# Altium project radFET-calibration_stand_card.PrjPcb
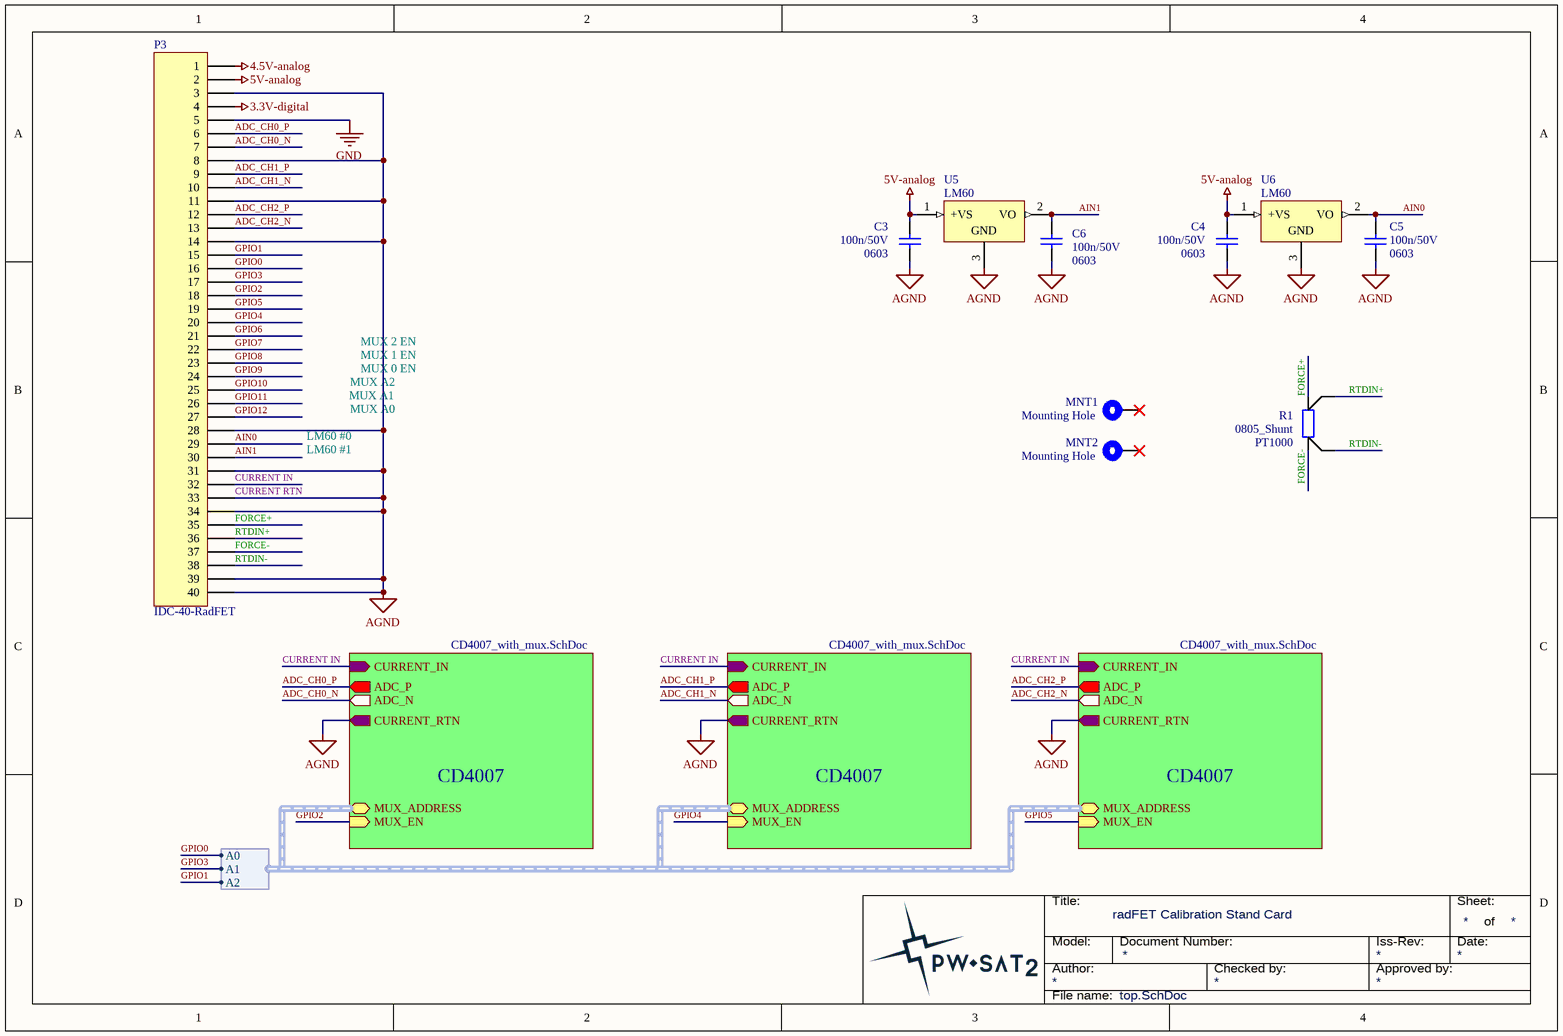
[diagram p0: top.SchDoc]
2 sheets, 100 parts. Net scope: hierarchical (ports join the sheet entries above them; power ports are global).
Board file: pcb.PcbDoc
Sheets:
  top.SchDoc
    CD4007 = CD4007_with_mux.SchDoc
    CD4007 = CD4007_with_mux.SchDoc
    CD4007 = CD4007_with_mux.SchDoc

## Sheet top.SchDoc: radFET Calibration Stand Card
size A4

### Parts
C3  Package: 0603  [SMD_Capacitor_0603]  (hidden comment: 100n/50V)
C4  Package: 0603  [SMD_Capacitor_0603]  (hidden comment: 100n/50V)
C5  Package: 0603  [SMD_Capacitor_0603]  (hidden comment: 100n/50V)
C6  Package: 0603  [SMD_Capacitor_0603]  (hidden comment: 100n/50V)
MNT1  Mounting Hole  [PC-104_PcbMntHole_M3]
MNT2  Mounting Hole  [PC-104_PcbMntHole_M3]
P3  IDC-40-RadFET  [IDC-40-Male-Socket-Angle]
R1  Package: 0805_Shunt  [SMD_Resistor-shunt_0805]  (hidden comment: PT1000)
U5  LM60  [SOT23-3]
U6  LM60  [SOT23-3]

### Sub-sheets
CD4007 = CD4007_with_mux.SchDoc: CURRENT_IN (in), ADC_P (out), ADC_N (out), MUX_EN (in), MUX_ADDRESS (harness MUX_Address), CURRENT_RTN (out)
CD4007 = CD4007_with_mux.SchDoc: CURRENT_IN (in), ADC_P (out), ADC_N (out), MUX_EN (in), MUX_ADDRESS (harness MUX_Address), CURRENT_RTN (out)
CD4007 = CD4007_with_mux.SchDoc: CURRENT_IN (in), ADC_P (out), ADC_N (out), MUX_EN (in), MUX_ADDRESS (harness MUX_Address), CURRENT_RTN (out)

### Harnesses
MUX_Address: A0, A1, A2

### Nets
3.3V-digital: P3.4
4.5V-analog: P3.1
5V-analog: C3.1 C4.1 P3.2 U5.1(+VS) U6.1(+VS)
CURRENT RTN: C3.2 C4.2 C5.2 C6.2 P3.3 P3.8 P3.11 P3.14 P3.28 P3.31 P3.33 P3.34 P3.39 P3.40 U5.3(GND) U6.3(GND) ; sheet CD4007/CURRENT_RTN, sheet CD4007/CURRENT_RTN, sheet CD4007/CURRENT_RTN  [also labelled AGND]
GND: P3.5
ADC_CH0_N: P3.7 ; sheet CD4007/ADC_N
ADC_CH0_P: P3.6 ; sheet CD4007/ADC_P
ADC_CH1_N: P3.10 ; sheet CD4007/ADC_N
ADC_CH1_P: P3.9 ; sheet CD4007/ADC_P
ADC_CH2_N: P3.13 ; sheet CD4007/ADC_N
ADC_CH2_P: P3.12 ; sheet CD4007/ADC_P
AIN0: C5.1 P3.29 U6.2(VO)
AIN1: C6.1 P3.30 U5.2(VO)
CURRENT IN: P3.32 ; sheet CD4007/CURRENT_IN, sheet CD4007/CURRENT_IN, sheet CD4007/CURRENT_IN
FORCE+: P3.35 R1.4
FORCE-: P3.37 R1.1
GPIO0: P3.16 ; sheet CD4007/MUX_ADDRESS.A0
GPIO1: P3.15 ; sheet CD4007/MUX_ADDRESS.A2
GPIO2: P3.18 ; sheet CD4007/MUX_EN
GPIO3: P3.17 ; sheet CD4007/MUX_ADDRESS.A1
GPIO4: P3.20 ; sheet CD4007/MUX_EN
GPIO5: P3.19 ; sheet CD4007/MUX_EN
GPIO6: P3.21
GPIO7: P3.22
GPIO8: P3.23
GPIO9: P3.24
GPIO10: P3.25
GPIO11: P3.26
GPIO12: P3.27
RTDIN+: P3.36 R1.3
RTDIN-: P3.38 R1.2

Not connected (* = marked no-connect by the designer): MNT1 1*; MNT2 1*

### Notes on the sheet
- MUX A2
- MUX 2 EN
- MUX 1 EN
- MUX 0 EN
- LM60 #0
- MUX A1
- MUX A0
- LM60 #1
- Title:
- Sheet:
- of
- Author:
- Model:
- Document Number:
- Checked by:
- Iss-Rev:
- Approved by:
- Date:
- File name:

### Library data of the parts
C3-C6 = Cer_C0603T104K5RALTU: Ceramic Cap Kemet COTS 100n/50V X7R 0603; Manufacturer: Kemet; ManufacturerPartNumber: C0603T104K5RALTU; Value: 100n/50V
MNT1 MNT2 = MntHole: PCB Mounting Hole; Value: Mounting Hole
R1 = PT1000: Platinum Thin-Film Chip Sensor; Manufacturer: IST INNOVATIVE SENSOR TECHNOLOGY; ManufacturerPartNumber: P1K0.0805.2P.A; TCR: 3850ppm/K; Farnell: http://pl.farnell.com/ist-innovative-sensor-technology/p1k0-0805-2p-a/sensor-pt1000-smd0805-class-a/dp/1266951; Manufacturer's Datasheet: http://www.farnell.com/datasheets/57422.pdf; Value: PT1000
U5 U6 = LM60: Analog temperature sensor
P3 = IDC-40-RadFET: LatestRevisionDate: 17-Jul-2002; LatestRevisionNote: Re-released for DXP Platform.; Publisher: Altium Limited

## Sheet CD4007_with_mux.SchDoc: CD4007 with mux
size A3
Used 3 times, as channels CD4007, CD4007, CD4007. Parts and nets are listed once, with the designators drawn on the sheet.
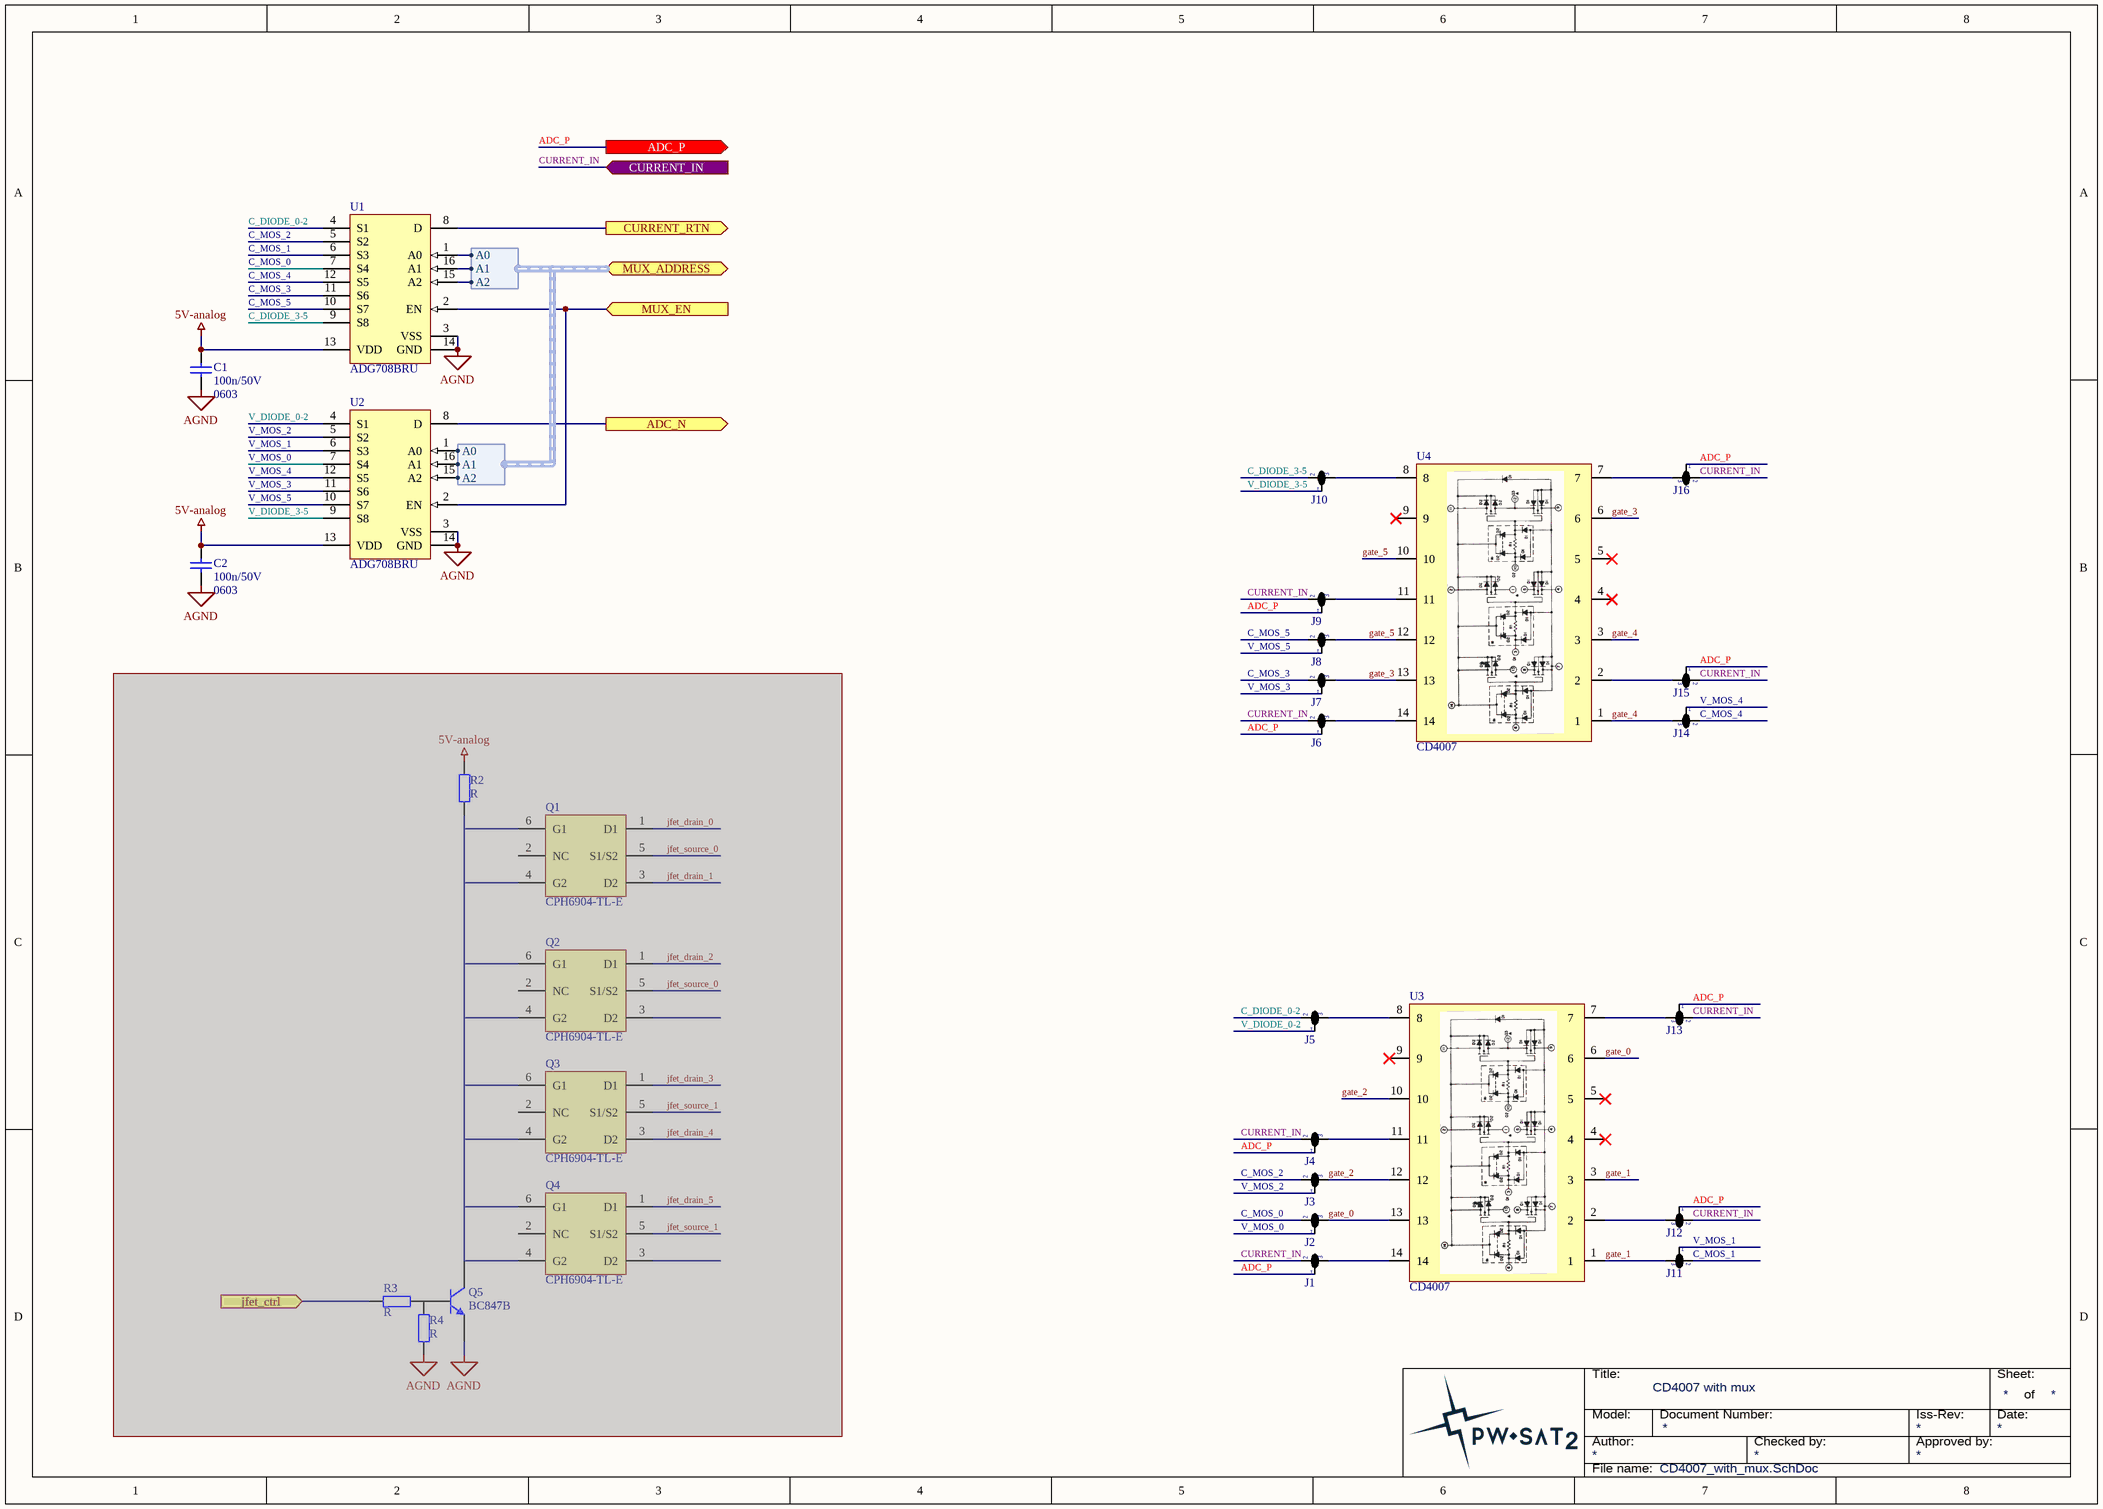
[diagram p1: CD4007_with_mux.SchDoc]

### Parts
C1  Package: 0603  [SMD_Capacitor_0603]  (hidden comment: 100n/50V)
C2  Package: 0603  [SMD_Capacitor_0603]  (hidden comment: 100n/50V)
J1  3 way net tie junction T shape  [3WaySplitter-RadFET - Test]  (value not drawn)  (net tie, no BOM)
J2  3 way net tie junction T shape  [3WaySplitter-RadFET - Test]  (value not drawn)  (net tie, no BOM)
J3  3 way net tie junction T shape  [3WaySplitter-RadFET - Test]  (value not drawn)  (net tie, no BOM)
J4  3 way net tie junction T shape  [3WaySplitter-RadFET - Test]  (value not drawn)  (net tie, no BOM)
J5  3 way net tie junction T shape  [3WaySplitter-RadFET - Test]  (value not drawn)  (net tie, no BOM)
J6  3 way net tie junction T shape  [3WaySplitter-RadFET - Test]  (value not drawn)  (net tie, no BOM)
J7  3 way net tie junction T shape  [3WaySplitter-RadFET - Test]  (value not drawn)  (net tie, no BOM)
J8  3 way net tie junction T shape  [3WaySplitter-RadFET - Test]  (value not drawn)  (net tie, no BOM)
J9  3 way net tie junction T shape  [3WaySplitter-RadFET - Test]  (value not drawn)  (net tie, no BOM)
J10  3 way net tie junction T shape  [3WaySplitter-RadFET - Test]  (value not drawn)  (net tie, no BOM)
J11  3 way net tie junction T shape  [3WaySplitter-RadFET - Test]  (value not drawn)  (net tie, no BOM)
J12  3 way net tie junction T shape  [3WaySplitter-RadFET - Test]  (value not drawn)  (net tie, no BOM)
J13  3 way net tie junction T shape  [3WaySplitter-RadFET - Test]  (value not drawn)  (net tie, no BOM)
J14  3 way net tie junction T shape  [3WaySplitter-RadFET - Test]  (value not drawn)  (net tie, no BOM)
J15  3 way net tie junction T shape  [3WaySplitter-RadFET - Test]  (value not drawn)  (net tie, no BOM)
J16  3 way net tie junction T shape  [3WaySplitter-RadFET - Test]  (value not drawn)  (net tie, no BOM)
Q1  CPH6904-TL-E  [ONSC-CPH-6_V]  (masked out: inside a compile mask, not in the netlist)
Q2  CPH6904-TL-E  [ONSC-CPH-6_V]  (masked out: inside a compile mask, not in the netlist)
Q3  CPH6904-TL-E  [ONSC-CPH-6_V]  (masked out: inside a compile mask, not in the netlist)
Q4  CPH6904-TL-E  [ONSC-CPH-6_V]  (masked out: inside a compile mask, not in the netlist)
Q5  BC847B  [SOT-23_M]  (masked out: inside a compile mask, not in the netlist)
R2  R  [0603]  (masked out: inside a compile mask, not in the netlist)
R3  R  [0603]  (masked out: inside a compile mask, not in the netlist)
R4  R  [0603]  (masked out: inside a compile mask, not in the netlist)
U1  ADG708BRU  [ADI-RU-16_N]
U2  ADG708BRU  [ADI-RU-16_N]
U3  CD4007  [TSSOP14]
U4  CD4007  [TSSOP14]

### Ports
ADC_N (out), ADC_P (out), CURRENT_IN (in), CURRENT_RTN (out), jfet_ctrl (in), MUX_ADDRESS (harness MUX_Address), MUX_EN (in)

### Harnesses
MUX_Address: A0, A1, A2

### Nets
5V-analog: C1.1 C2.1 U1.13(VDD) U2.13(VDD)
AGND: C1.2 C2.2 U1.3(VSS) U1.14(GND) U2.3(VSS) U2.14(GND)
ADC_N: U2.8(D) ; port ADC_N
ADC_P: J1.1 J4.1 J6.1 J9.1 J12.1 J13.1 J15.1 J16.1 ; port ADC_P
C_DIODE_0-2: J5.2 U1.4(S1)
C_DIODE_3-5: J10.2 U1.9(S8)
C_MOS_0: J2.2 U1.7(S4)
C_MOS_1: J11.2 U1.6(S3)
C_MOS_2: J3.2 U1.5(S2)
C_MOS_3: J7.2 U1.11(S6)
C_MOS_4: J14.2 U1.12(S5)
C_MOS_5: J8.2 U1.10(S7)
CURRENT_IN: J1.2 J4.2 J6.2 J9.2 J12.2 J13.2 J15.2 J16.2 ; port CURRENT_IN
CURRENT_RTN: U1.8(D) ; port CURRENT_RTN
gate_0: J2.3 U3.6 U3.13
gate_1: J11.3 U3.1 U3.3
gate_2: J3.3 U3.10 U3.12
gate_3: J7.3 U4.6 U4.13
gate_4: J14.3 U4.1 U4.3
gate_5: J8.3 U4.10 U4.12
MUX_EN: U1.2(EN) U2.2(EN) ; port MUX_EN
V_DIODE_0-2: J5.1 U2.4(S1)
V_DIODE_3-5: J10.1 U2.9(S8)
V_MOS_0: J2.1 U2.7(S4)
V_MOS_1: J11.1 U2.6(S3)
V_MOS_2: J3.1 U2.5(S2)
V_MOS_3: J7.1 U2.11(S6)
V_MOS_4: J14.1 U2.12(S5)
V_MOS_5: J8.1 U2.10(S7)
NetJ1_3: J1.3 U3.14
NetJ4_3: J4.3 U3.11
NetJ5_3: J5.3 U3.8
NetJ6_3: J6.3 U4.14
NetJ9_3: J9.3 U4.11
NetJ10_3: J10.3 U4.8
NetJ12_3: J12.3 U3.2
NetJ13_3: J13.3 U3.7
NetJ15_3: J15.3 U4.2
NetJ16_3: J16.3 U4.7
NetU1_1: U1.1(A0) U2.1(A0) ; port MUX_ADDRESS.A0
NetU1_15: U1.15(A2) U2.15(A2) ; port MUX_ADDRESS.A2
NetU1_16: U1.16(A1) U2.16(A1) ; port MUX_ADDRESS.A1

Not connected (* = marked no-connect by the designer): U3 4* 5* 9*; U4 4* 5* 9*

### Channels
CD4007: designators C1=C1_CD40073 C2=C2_CD40073 J1=J1_CD40073 J2=J2_CD40073 J3=J3_CD40073 J4=J4_CD40073 J5=J5_CD40073 J6=J6_CD40073 J7=J7_CD40073 J8=J8_CD40073 J9=J9_CD40073 J10=J10_CD40073 J11=J11_CD40073 J12=J12_CD40073 J13=J13_CD40073 J14=J14_CD40073 J15=J15_CD40073 J16=J16_CD40073 Q1=Q1_CD4007#1 Q2=Q2_CD4007#1 Q3=Q3_CD4007#1 Q4=Q4_CD4007#1 Q5=Q5_CD4007#1 R2=R2_CD4007#1 R3=R3_CD4007#1 R4=R4_CD4007#1 U1=U1_CD40073 U2=U2_CD40073 U3=U3_CD40073 U4=U4_CD40073; ports ADC_N=ADC_CH0_N ADC_P=ADC_CH0_P CURRENT_IN=CURRENT IN CURRENT_RTN=CURRENT RTN MUX_EN=GPIO2
CD4007: designators C1=C1_CD40072 C2=C2_CD40072 J1=J1_CD40072 J2=J2_CD40072 J3=J3_CD40072 J4=J4_CD40072 J5=J5_CD40072 J6=J6_CD40072 J7=J7_CD40072 J8=J8_CD40072 J9=J9_CD40072 J10=J10_CD40072 J11=J11_CD40072 J12=J12_CD40072 J13=J13_CD40072 J14=J14_CD40072 J15=J15_CD40072 J16=J16_CD40072 Q1=Q1_CD4007#2 Q2=Q2_CD4007#2 Q3=Q3_CD4007#2 Q4=Q4_CD4007#2 Q5=Q5_CD4007#2 R2=R2_CD4007#2 R3=R3_CD4007#2 R4=R4_CD4007#2 U1=U1_CD40072 U2=U2_CD40072 U3=U3_CD40072 U4=U4_CD40072; ports ADC_N=ADC_CH1_N ADC_P=ADC_CH1_P CURRENT_IN=CURRENT IN CURRENT_RTN=CURRENT RTN MUX_EN=GPIO4
CD4007: designators C1=C1_CD40071 C2=C2_CD40071 J1=J1_CD40071 J2=J2_CD40071 J3=J3_CD40071 J4=J4_CD40071 J5=J5_CD40071 J6=J6_CD40071 J7=J7_CD40071 J8=J8_CD40071 J9=J9_CD40071 J10=J10_CD40071 J11=J11_CD40071 J12=J12_CD40071 J13=J13_CD40071 J14=J14_CD40071 J15=J15_CD40071 J16=J16_CD40071 Q1=Q1_CD4007#3 Q2=Q2_CD4007#3 Q3=Q3_CD4007#3 Q4=Q4_CD4007#3 Q5=Q5_CD4007#3 R2=R2_CD4007#3 R3=R3_CD4007#3 R4=R4_CD4007#3 U1=U1_CD40071 U2=U2_CD40071 U3=U3_CD40071 U4=U4_CD40071; ports ADC_N=ADC_CH2_N ADC_P=ADC_CH2_P CURRENT_IN=CURRENT IN CURRENT_RTN=CURRENT RTN MUX_EN=GPIO5

### Notes on the sheet
- Title:
- Sheet:
- of
- Author:
- Model:
- Document Number:
- Checked by:
- Iss-Rev:
- Approved by:
- Date:
- File name:

### Library data of the parts
C1 C2 = Cer_C0603T104K5RALTU: Ceramic Cap Kemet COTS 100n/50V X7R 0603; Manufacturer: Kemet; ManufacturerPartNumber: C0603T104K5RALTU; Value: 100n/50V
J1-J16 = 3wayT-RadFET: Note: 2 display modes available; ComponentLink1URL: http://www.edatools.cz/addons; ComponentLink1Description: Source; FootprintNote: LP=12mil, MP=40mil, HP=120mil
Q1-Q4 = CPH6904-TL-E: N-Channel JFET, 25 V, 20 to 40 mA, 40 mS, Dual, 6-Pin CPH, Pb-Free, Tape and Reel; Manufacturer: On Semiconductor; Channel Polarity: N Channel; IDSS Max (uA): 40000; IDSS Min (uA): 20000; PackageReference: CPH-6; PackageDescription: 6-Pin Small Outline Transistor, Body 2.9 x 1.6 mm, Pitch 0.95 mm; Supplier 1: Digi-Key; Supplier Part Number 1: CPH6904-TL-E-ND; Supplier 2: Newark; Supplier Part Number 2: 07W6759; Supplier 3: Mouser; Supplier Part Number 3: 863-CPH6904-TL-E; Packing: Tape and Reel; RoHS: Pb-Free; Mounting Technology: Surface Mount; PartNumber: CPH6904-TL-E; ComponentLink1Description: Manufacturer URL; ComponentLink1URL: http://www.onsemi.com/; ComponentLink2Description: Datasheet; ComponentLink2URL: http://www.onsemi.com/pub/Collateral/ENA1966-D.PDF; ComponentLink3Description: Package Specification; ComponentLink3URL: http://www.onsemi.com/pub_link/Collateral/CPH6001A-D.PDF
Q5 = BC847B: NPN transistor; Manufacturer: Multicomp; Manufacturer Part Number: BC847B; ComponentLink1URL: http://www.farnell.com/datasheets/1685010.pdf; ComponentLink1Description: Datasheet; HelpURL: http://www.farnell.com/datasheets/1685010.pdf; value: BC847B; Supplier 1: TME; Supplier 2: RS Components; Supplier 3: Farnell; Supplier 4: Mouser; Supplier 5: Digi-Key; Supplier Part Number 1: BC847B-DIO; Supplier Part Number 2: 4452023; Supplier Part Number 3: 2464041; Supplier Part Number 4: 863-BC847BTT1G; Supplier Part Number 5: BC847B-7FDITR-ND
R2-R4 = Res: Generic resistor; value: R
U1 U2 = ADG708BRU: 1.8 to 5.5 V / +/-2.5 V, CMOS Low Voltage 3 Ohm, 8-Channel Multiplexer, -40 to 125 degC, 16-pin SOP (RU-16), Tube; Manufacturer: Analog Devices; Bandwidth (Hz): 55M; Max Analog Signal Range: Vss to Vdd; Ron (ohms): 3; Supply V Guar Performance: Dual_(+/-2.5V), Single_(+3V), Single_(+5V); t transition (s): 14n; DatasheetVersion: Rev. C; PackageVersion: Nov-02; PackageReference: RU-16; PackageDescription: 16-Pin Thin Shrink Small Outline Package, Body 5 x 4.4 mm, Pitch 0.65 mm; Supplier 1: Digi-Key; Supplier Part Number 1: ADG708BRU-ND; Supplier 2: Mouser; Supplier Part Number 2: 584-ADG708BRU; Packing: Tube; Mounting Technology: Surface Mount; Code_JEDEC: MO-153AB; PartNumber: ADG708BRU; ComponentLink1Description: Manufacturer URL; ComponentLink1URL: http://www.analog.com/en/index.html; ComponentLink2Description: Datasheet; ComponentLink2URL: http://www.analog.com/static/imported-files/data_sheets/ADG708_709.pdf; ComponentLink3Description: Package Specification; ComponentLink3URL: http:/www.analog.com/static/imported-files/packages/36244347913743854010197452789RU16.pdf
U3 U4 = CD4007: CMOS Dual Complementary Pair Plus Inverter; ComponentLink1URL: http://www.mouser.com/catalog/specsheets/AT45DB041D.pdf; ComponentLink1Description: Datasheet

## Nets that join several sheets
5V-analog: top (5 pins), CD4007 (C1_CD40073.1 C2_CD40073.1 U1_CD40073.13 U2_CD40073.13), CD4007 (C1_CD40072.1 C2_CD40072.1 U1_CD40072.13 U2_CD40072.13), CD4007 (C1_CD40071.1 C2_CD40071.1 U1_CD40071.13 U2_CD40071.13)
CURRENT RTN: top (16 pins), CD4007 (7 pins), CD4007 (7 pins), CD4007 (7 pins)
ADC_CH0_N: top (P3.7), CD4007 (U2_CD40073.8)
ADC_CH0_P: top (P3.6), CD4007 (8 pins)
ADC_CH1_N: top (P3.10), CD4007 (U2_CD40072.8)
ADC_CH1_P: top (P3.9), CD4007 (8 pins)
ADC_CH2_N: top (P3.13), CD4007 (U2_CD40071.8)
ADC_CH2_P: top (P3.12), CD4007 (8 pins)
CURRENT IN: top (P3.32), CD4007 (8 pins), CD4007 (8 pins), CD4007 (8 pins)
GPIO0: top (P3.16), CD4007 (U1_CD40073.1 U2_CD40073.1), CD4007 (U1_CD40072.1 U2_CD40072.1), CD4007 (U1_CD40071.1 U2_CD40071.1)
GPIO1: top (P3.15), CD4007 (U1_CD40073.15 U2_CD40073.15), CD4007 (U1_CD40072.15 U2_CD40072.15), CD4007 (U1_CD40071.15 U2_CD40071.15)
GPIO2: top (P3.18), CD4007 (U1_CD40073.2 U2_CD40073.2)
GPIO3: top (P3.17), CD4007 (U1_CD40073.16 U2_CD40073.16), CD4007 (U1_CD40072.16 U2_CD40072.16), CD4007 (U1_CD40071.16 U2_CD40071.16)
GPIO4: top (P3.20), CD4007 (U1_CD40072.2 U2_CD40072.2)
GPIO5: top (P3.19), CD4007 (U1_CD40071.2 U2_CD40071.2)